# Altium schematic sheet main.SchDoc
size A4
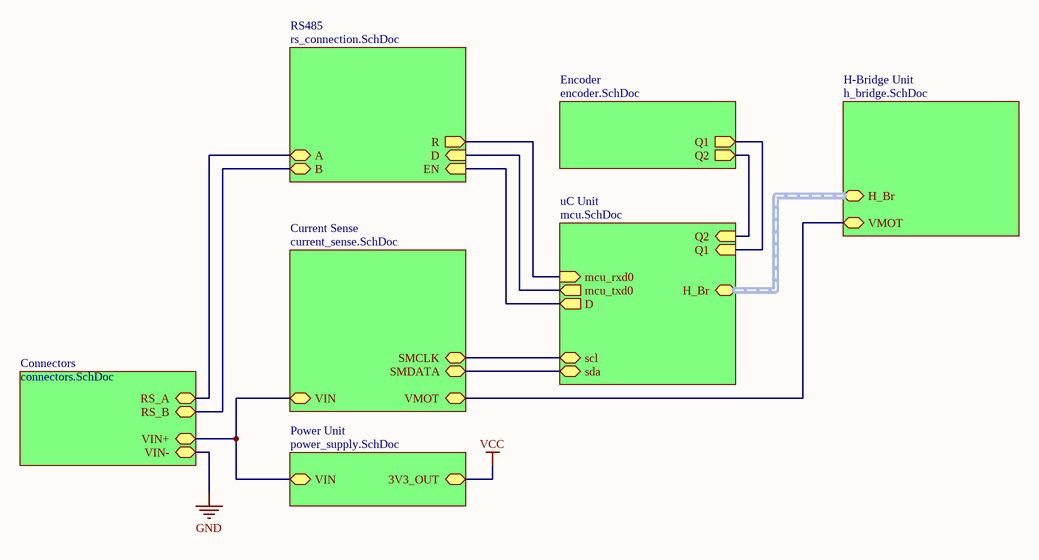
[diagram p0: main.SchDoc]

## Sub-sheets
Connectors = connectors.SchDoc: VIN+, RS_B, RS_A, VIN-
Current Sense = current_sense.SchDoc: SMCLK, SMDATA, VIN, VMOT
Encoder = encoder.SchDoc: Q2 (out), Q1 (out)
H-Bridge Unit = h_bridge.SchDoc: H_Br (harness H_Bridge_Harness), VMOT
Power Unit = power_supply.SchDoc: VIN, 3V3_OUT
RS485 = rs_connection.SchDoc: A, B, EN (in), D (in), R (out)
uC Unit = mcu.SchDoc: H_Br (harness H_Bridge_Harness), mcu_rxd0 (in), mcu_txd0 (out), scl (bidir), sda (bidir), D (out), Q1 (in), Q2 (in)

## Nets
GND: sheet Connectors/VIN-
VCC: sheet Power Unit/3V3_OUT
(unnamed): sheet Power Unit/VIN, sheet Current Sense/VIN, sheet Connectors/VIN+
(unnamed): sheet uC Unit/mcu_rxd0, sheet RS485/R
(unnamed): sheet uC Unit/mcu_txd0, sheet RS485/D
(unnamed): sheet uC Unit/scl, sheet Current Sense/SMCLK
(unnamed): sheet uC Unit/sda, sheet Current Sense/SMDATA
(unnamed): sheet uC Unit/D, sheet RS485/EN
(unnamed): sheet uC Unit/Q1, sheet Encoder/Q1
(unnamed): sheet uC Unit/Q2, sheet Encoder/Q2
(unnamed): sheet H-Bridge Unit/VMOT, sheet Current Sense/VMOT
(unnamed): sheet RS485/A, sheet Connectors/RS_A
(unnamed): sheet RS485/B, sheet Connectors/RS_B

## Buses and harness runs
harness sheet H-Bridge Unit/H_Br = sheet uC Unit/H_Br